# Altium schematic sheet P09_10_100 Ethernet.SchDoc
size 386 x 246 mm
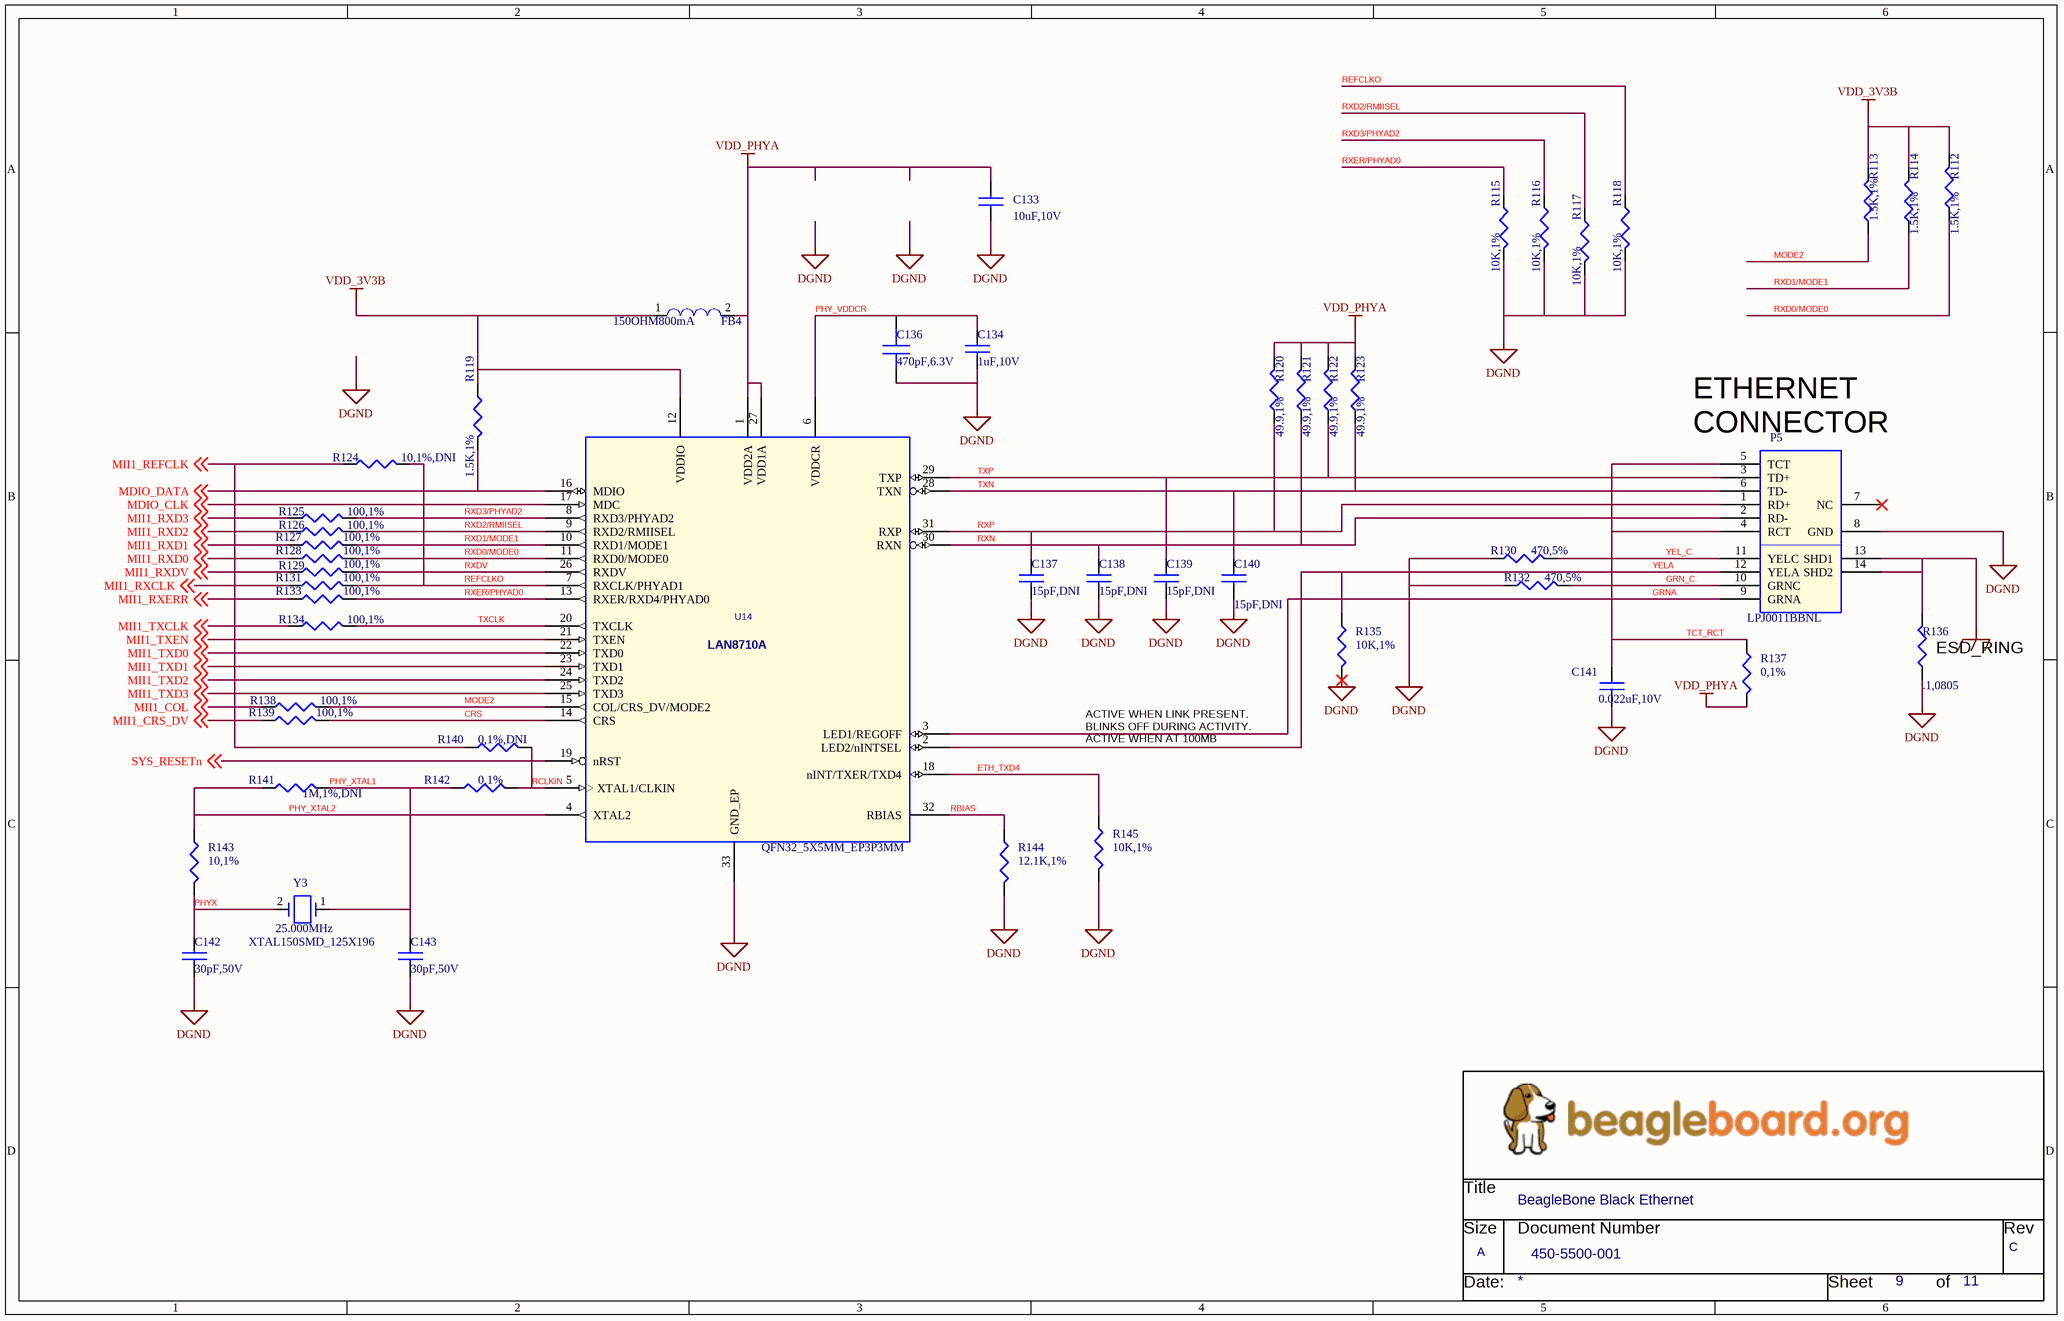
[diagram p0: P09_10_100 Ethernet.SchDoc]

## Parts
*  Page Count: 11  Page Number: 9  Page Size: A  Title: BeagleBone Black Ethernet  RevCode: C  Doc: 450-5500-001  (hidden comment: BeagleBoard_org)  (graphical)
C133  10uF,10V  [r402-25rd]
C134  1uF,10V  [402]
C136  470pF,6.3V  [0603]
C137  15pF,DNI  [r402-25rd]
C138  15pF,DNI  [r402-25rd]
C139  15pF,DNI  [r402-25rd]
C140  15pF,DNI  [r402-25rd]
C141  0.022uF,10V  [c402-25]
C142  30pF,50V  [402]
C143  30pF,50V  [402]
FB4  150OHM800mA  [L0805]
P5  LPJ0011BBNL  [RJ45-BEL_J1-SHLD]
R112  1.5K,1%  [402]
R113  1.5K,1%  [402]
R114  1.5K,1%  [402]
R115  10K,1%  [402]
R116  10K,1%  [402]
R117  10K,1%  [402]
R118  10K,1%  [402]
R119  1.5K,1%  [402]
R120  49.9,1%  [r402-25rd]
R121  49.9,1%  [r402-25rd]
R122  49.9,1%  [r402-25rd]
R123  49.9,1%  [r402-25rd]
R124  10,1%,DNI  [0603]
R125  100,1%  [0603]
R126  100,1%  [0603]
R127  100,1%  [402]
R128  100,1%  [402]
R129  100,1%  [0603]
R130  470,5%  [402]
R131  100,1%  [402]
R132  470,5%  [402]
R133  100,1%  [402]
R134  100,1%  [0603]
R135  10K,1%  [402]
R136  .1,0805  [R805-35X60]
R137  0,1%  [402]
R138  100,1%  [0603]
R139  100,1%  [402]
R140  0,1%,DNI  [402]
R141  1M,1%,DNI  [402]
R142  0,1%  [402]
R143  10,1%  [402]
R144  12.1K,1%  [402]
R145  10K,1%  [402]
U14  LAN8710A  [QFN32_5X5MM_EP3P3MM]
Y3  25.000MHz  PCB Footprint: XTAL150SMD_125X196  [HC49US]

## Nets
DGND: C133.1 C134.2 C136.2 C137.2 C138.2 C139.2 C140.2 C141.2 C142.2 C143.2 P5.8(GND) R115.2 R116.2 R117.2 R118.2 R130.1 R132.1 R135.2 R136.1 R144.2 R145.2 U14.33(GND_EP)
GND_EARTH: P5.13(SHD1) P5.14(SHD2) R136.2
VDD_3V3B: FB4.1 R112.2 R113.2 R114.2 R119.1 U14.12(VDDIO)
VDD_PHYA: C133.2 FB4.2 R120.2 R121.2 R122.2 R123.2 R137.2 U14.1(VDD2A) U14.27(VDD1A)
CRS: R139.2 U14.14(CRS)
ETH_TXD4: R145.1 U14.18(nINT/TXER/TXD4)
GRN_C: P5.10(GRNC) R132.2
GRNA: P5.9(GRNA) U14.3(LED1/REGOFF)
MDIO_CLK: U14.17(MDC) ; off-sheet MDIO_CLK
MDIO_DATA: R119.2 U14.16(MDIO) ; off-sheet MDIO_DATA
MII1_COL: R138.1 ; off-sheet MII1_COL
MII1_CRS_DV: R139.1 ; off-sheet MII1_CRS_DV
MII1_REFCLK: R124.1 R140.1 ; off-sheet MII1_REFCLK
MII1_RXCLK: R131.1 ; off-sheet MII1_RXCLK
MII1_RXD0: R128.1 ; off-sheet MII1_RXD0
MII1_RXD1: R127.1 ; off-sheet MII1_RXD1
MII1_RXD2: R126.1 ; off-sheet MII1_RXD2
MII1_RXD3: R125.1 ; off-sheet MII1_RXD3
MII1_RXDV: R129.1 ; off-sheet MII1_RXDV
MII1_RXERR: R133.1 ; off-sheet MII1_RXERR
MII1_TXCLK: R134.1 ; off-sheet MII1_TXCLK
MII1_TXD0: U14.22(TXD0) ; off-sheet MII1_TXD0
MII1_TXD1: U14.23(TXD1) ; off-sheet MII1_TXD1
MII1_TXD2: U14.24(TXD2) ; off-sheet MII1_TXD2
MII1_TXD3: U14.25(TXD3) ; off-sheet MII1_TXD3
MII1_TXEN: U14.21(TXEN) ; off-sheet MII1_TXEN
MODE2: R113.1 R138.2 U14.15(COL/CRS_DV/MODE2)
PHY_VDDCR: C134.1 C136.1 U14.6(VDDCR)
PHY_XTAL1: C143.1 R141.2 R142.1 Y3.1
PHY_XTAL2: R141.1 R143.1 U14.4(XTAL2)
PHYX: C142.1 R143.2 Y3.2
RBIAS: R144.1 U14.32(RBIAS)
RCLKIN: R140.2 R142.2 U14.5(XTAL1/CLKIN)
REFCLKO: R118.1 R124.2 R131.2 U14.7(RXCLK/PHYAD1)
RXD0/MODE0: R112.1 R128.2 U14.11(RXD0/MODE0)
RXD1/MODE1: R114.1 R127.2 U14.10(RXD1/MODE1)
RXD2/RMIISEL: R117.1 R126.2 U14.9(RXD2/RMIISEL)
RXD3/PHYAD2: R116.1 R125.2 U14.8(RXD3/PHYAD2)
RXDV: R129.2 U14.26(RXDV)
RXER/PHYAD0: R115.1 R133.2 U14.13(RXER/RXD4/PHYAD0)
RXN: C138.1 P5.2(RD-) R121.1 U14.30(RXN)
RXP: C137.1 P5.1(RD+) R120.1 U14.31(RXP)
SYS_RESETn: U14.19(nRST) ; off-sheet SYS_RESETn
TCT_RCT: C141.1 P5.4(RCT) P5.5(TCT) R137.1
TXCLK: R134.2 U14.20(TXCLK)
TXN: C140.1 P5.6(TD-) R123.1 U14.28(TXN)
TXP: C139.1 P5.3(TD+) R122.1 U14.29(TXP)
YEL_C: P5.11(YELC) R130.2
YELA: P5.12(YELA) R135.1 U14.2(LED2/nINTSEL)

Not connected (* = marked no-connect by the designer): P5 7(NC)*

## Notes on the sheet
- (near P5) ETHERNET
  CONNECTOR
- (near R136) ESD_RING
- ACTIVE WHEN LINK PRESENT.
  BLINKS OFF DURING ACTIVITY.
- ACTIVE WHEN AT 100MB
- (in symbol BeagleBoard_org) Title; Size; Document Number; Rev; Date:; Sheet; of

## Library data of the parts
C133 = CAP_10uF_Y5V_10V_10%_0805: Desc: CAP CER 10UF 10V Y5V 0805; PCB Footprint: 805; Part Number: CAP_10uF_Y5V_10V_10%_0805
C134 = CAP_1.0UF_X5R_10V_10%_0402: Desc: CAP, CER, X7R, 0402, 50V, 10%, 0.1uF; Part Number: CAP_1.0uF_X5R_10V_10%_0402; PCB Footprint: 402
C136 = 470pF/5%/50V/C0G/0603_0: PART#: Murata GCM1885C1H471JA16D; TOLERANCE: 5%; VOLTAGE: 50V; PCB Footprint: 0402; DIELECTRIC: C0G; Ratings: AEC-Q200
C137-C140 = CAP_0402_100pF_COG_50V: Desc: CAP, CER, X7R, 0402, 10V, 10%, 0.1uF; PCB Footprint: 402
C141 = CAP_0402_0.1uf_X5R_10V: Desc: CAP, CER, X7R, 0402, 10V, 10%, 0.1uF; PCB Footprint: 402
C142 C143 = CAP_30PF_COG_50V_5%_0402: Desc: CAP, CER, X7R, 0402, 50V, 10%, 0.1uF; Part Number: CAP_30PF_COG_50V_5%_0402; PCB Footprint: 402
FB4 = FER_180_200_0: Ferrite Bead 150 Ohm 800mA; Part Number: FER_180_200_0805; TIIntPartnumber: 1L0010; MfrNum: LI0805H151R-10; Mfr: Steward; PCB Footprint: 805; Vendor: Digikey; PartName: FerriteBead150ohm800mA
P5 = CONN_RJ45_MAG_WE_0: PCB Footprint: RJ45-7499010211A
R112-R118 = RES_4.75K_1/16W_1%_0402: RES 4.75K OHM 1/16W 1% 0402 SMD; Part Number: RES_4.75K_1/16W_1%_0402; PCB Footprint: 402
R119 = RES_1.5K_1/16W_5%_0402_Dup1: RES 1.5K OHM 1/16W 5% 0402 SMD; Part Number: RES_1.5K_1/16W_5%_0402; PCB Footprint: 402
R120-R123 = RES_4.7K_0402: PCB Footprint: 402
R124-R126 R129 R134 R138 = 100-1/10W-1%-0603_4: PART#: Rohm MCR03EZPFX1000; Wattage: 1/10W; PCB Footprint: 0603; Tolerance: 1%
R127 R128 R131 R133 R139 = RES_100_1/10W_5%_0402: RES 100 OHM 1/10W 5% 0402 SMD; Part Number: RES_100_1/10W_5%_0402; PCB Footprint: 402
R130 R132 = RES_470_1/10W_5%_0402: RES 470 OHM 1/10W 5% 0402 SMD; Part Number: RES_470_1/10W_5%_0402; PCB Footprint: 402
R135 R137 R143 R145 = RES_10K_1/16W_1%_0402_Dup1: Resistor 10Kohm 1/16W 1% 0402; Part Number: RES_10K_1/16W_1%_0402; PCB Footprint: 402
R136 = RES_0.1_0805: PCB Footprint: 805
R140 R142 = RES_0_1/16W_1%_0402_Dup1: Resistor Zero ohm Jumper 0402; Part Number: RES_0_1/16W_1%_0402; PCB Footprint: 402
R141 = RES_1M_1/16W_1%_0402: Resistor 1Mohm 1/16W 1% 0402; Part Number: RES_1M_1/16W_1%_0402; PCB Footprint: 402
R144 = RES_12.1K_1/16W_1%_0402: RES 12.1K OHM 1/16W 1% 0402 SMD; Part Number: RES_12.1K_1/16W_1%_0402; PCB Footprint: 402
U14 = LAN8710 QFN32_1: PART#: SMSC LAN8710A-EZK; PCB Footprint: QFN32_5X5MM_EP3P3MM
Y3 = Suntsu ITEMP 25MHz _0.005% 20pf: PART#: Suntsu Freq. SCS20D48-25.000MHZ
* = BeagleBoard_org: Page Create Date: March  8, 1995; Page Modify Date: *